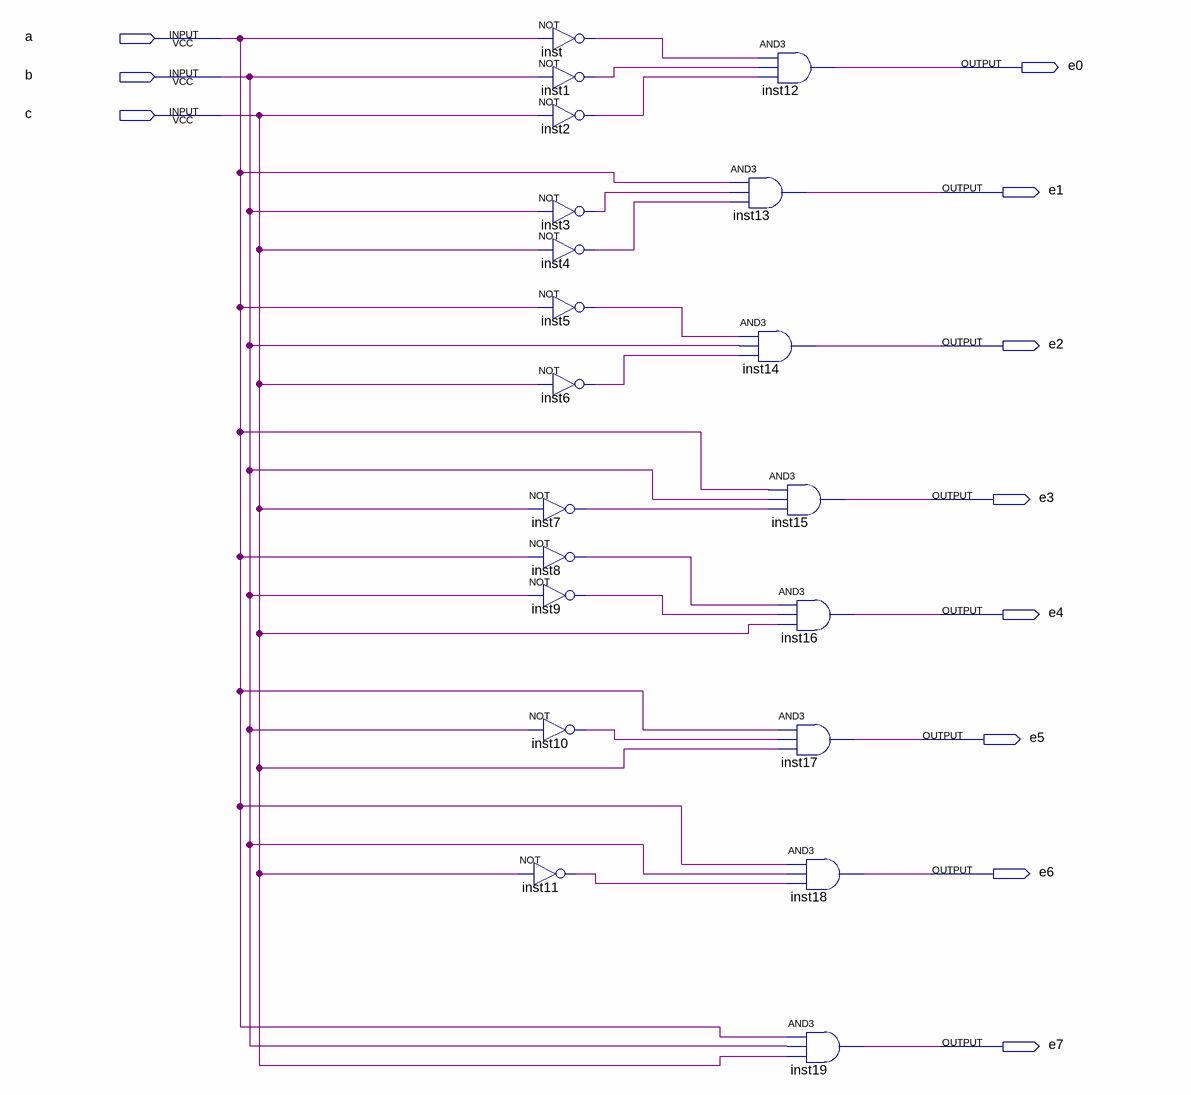
[diagram p0: schematic sheet]
// Quartus schematic 3_bit_sel.bdf as structural Verilog: 20 symbols, 11 pins
module \3_bit_sel  (
  input  a,
  input  b,
  input  c,
  output e0,
  output e1,
  output e2,
  output e3,
  output e4,
  output e5,
  output e6,
  output e7
);

  wire inst1_out, inst2_out, inst3_out, inst4_out, inst5_out, inst6_out, inst7_out, inst8_out, inst9_out,
       inst10_out, inst11_out, inst_out;

  not inst (inst_out, a);
  not inst1 (inst1_out, b);
  not inst2 (inst2_out, c);
  not inst3 (inst3_out, b);
  not inst4 (inst4_out, c);
  not inst5 (inst5_out, a);
  not inst6 (inst6_out, c);
  not inst7 (inst7_out, c);
  not inst8 (inst8_out, a);
  not inst9 (inst9_out, b);
  not inst10 (inst10_out, b);
  not inst11 (inst11_out, c);
  and inst12 (e0, inst_out, inst1_out, inst2_out);
  and inst13 (e1, a, inst3_out, inst4_out);
  and inst14 (e2, inst5_out, b, inst6_out);
  and inst15 (e3, a, b, inst7_out);
  and inst16 (e4, inst8_out, inst9_out, c);
  and inst17 (e5, a, inst10_out, c);
  and inst18 (e6, a, b, inst11_out);
  and inst19 (e7, a, b, c);
endmodule
